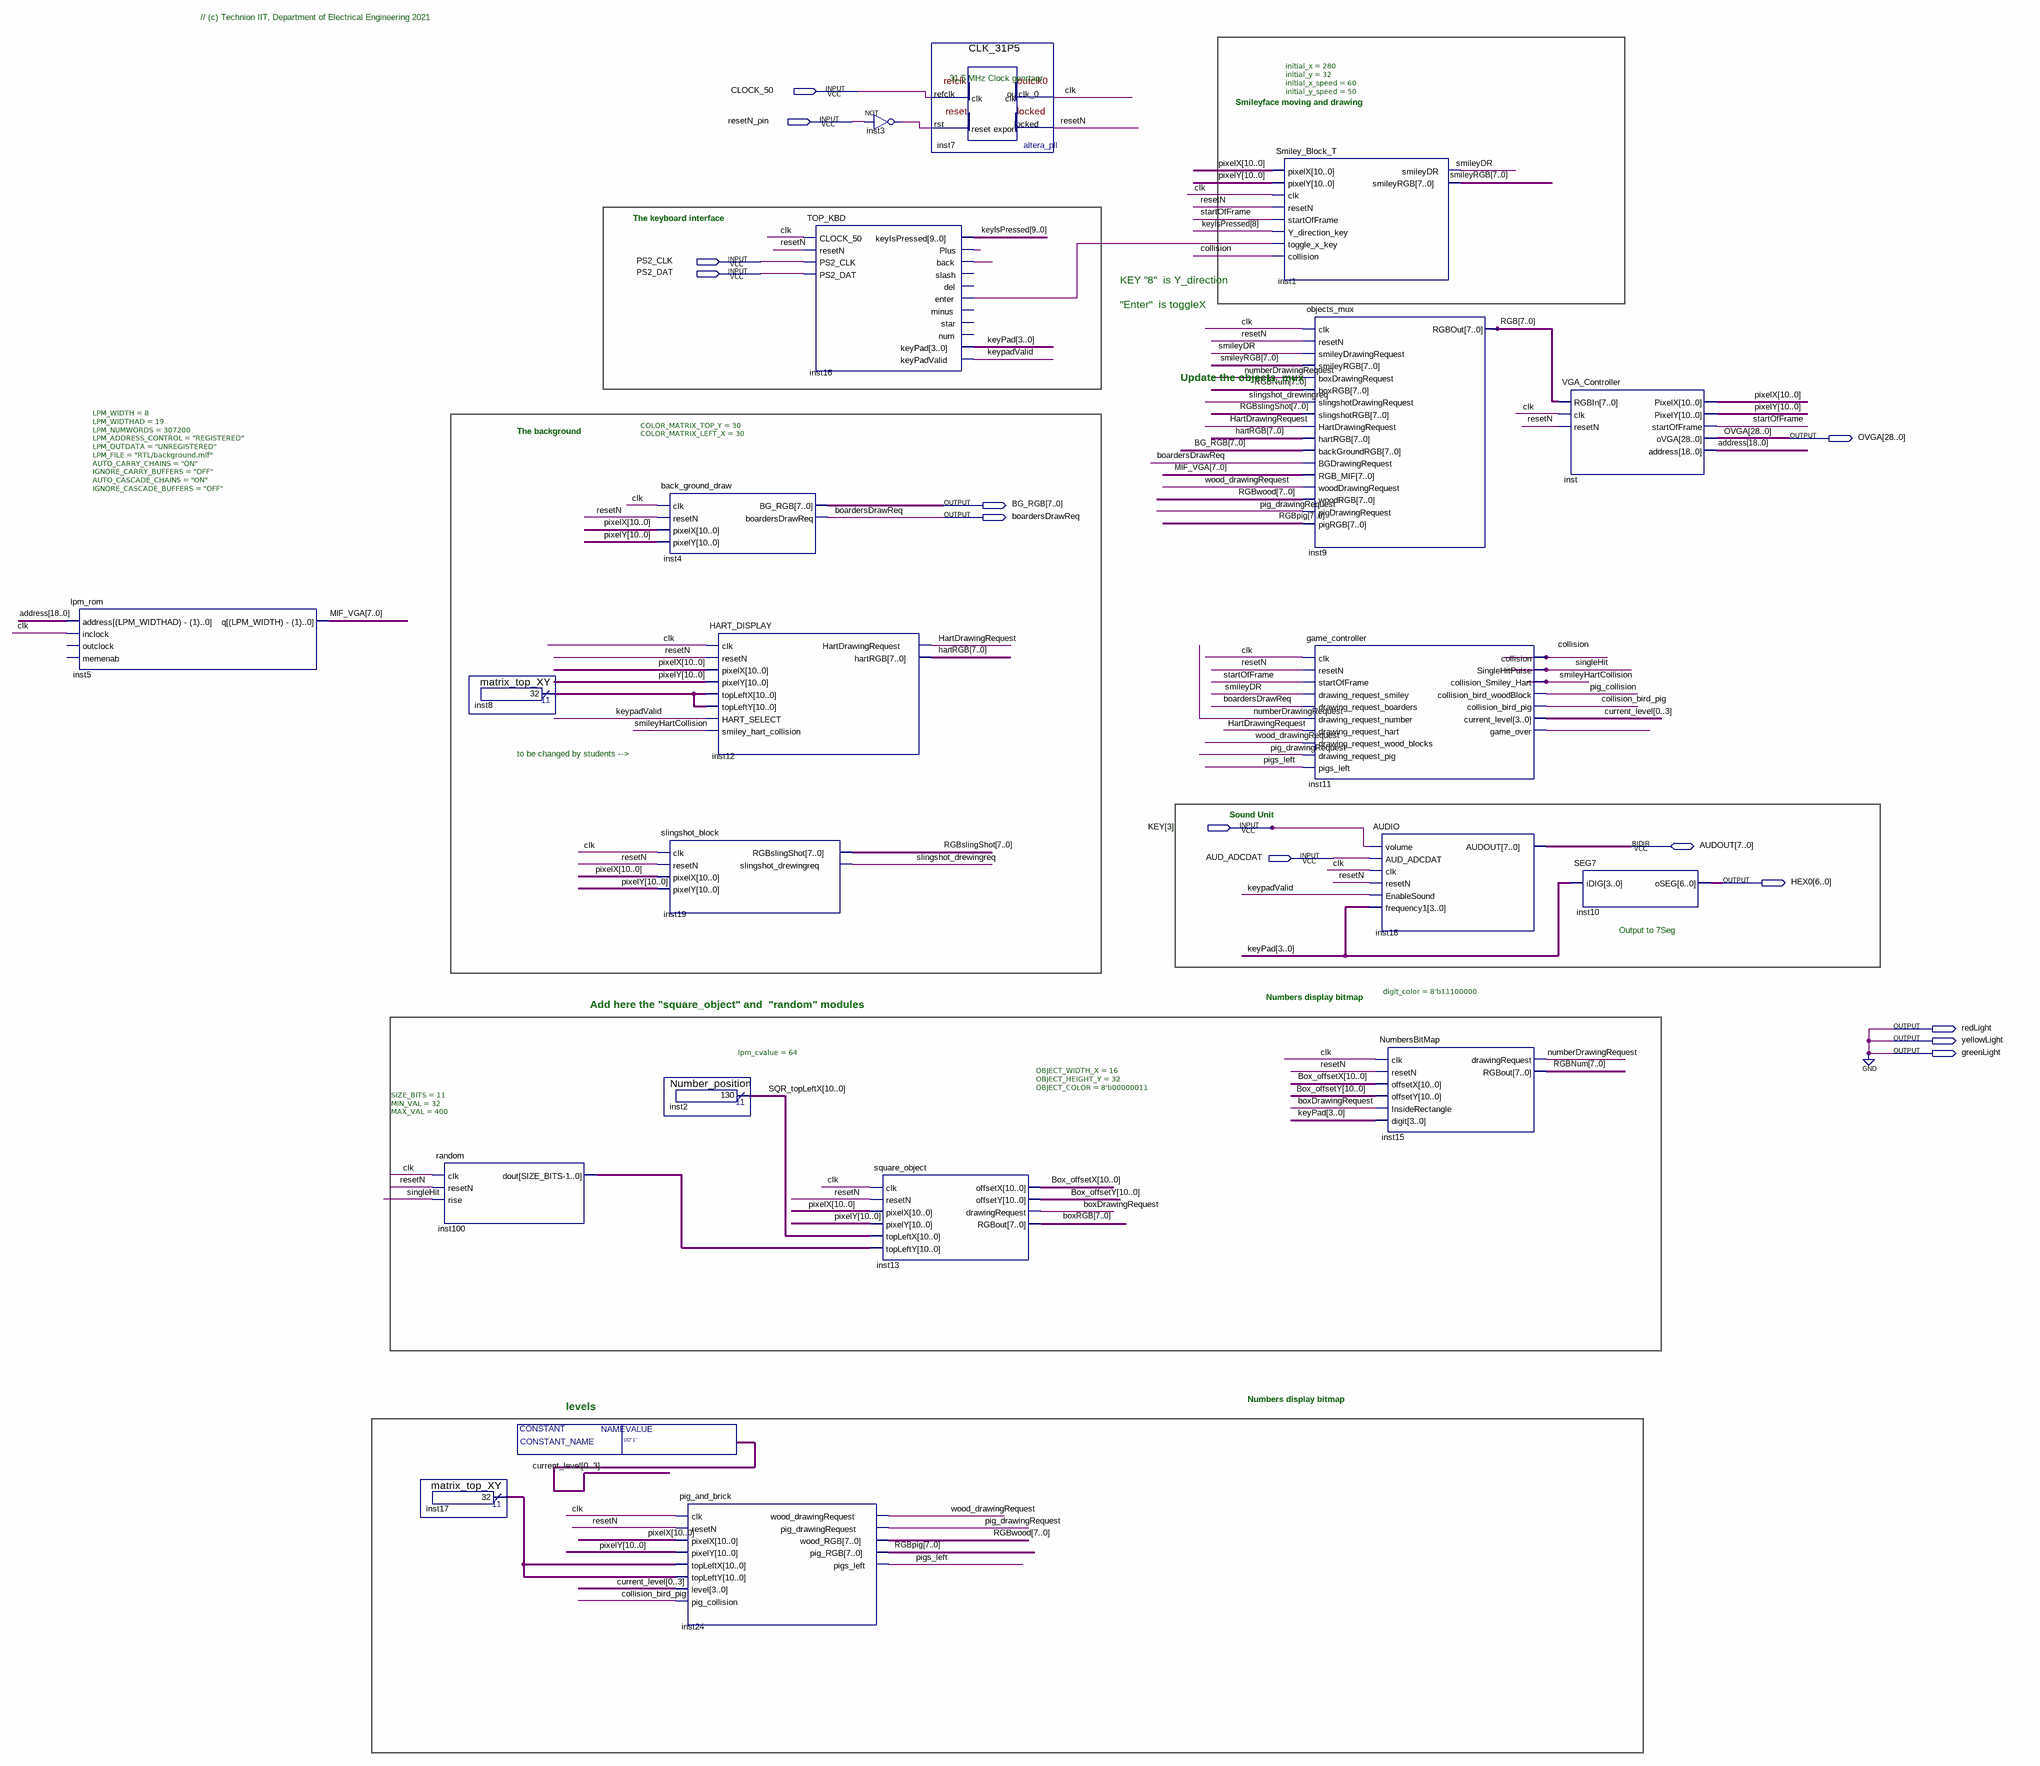
[diagram p0: schematic sheet]
// Quartus schematic TOP_VGA_DEMO_KBD_TWO.bdf as structural Verilog: 20 symbols, 14 pins
module TOP_VGA_DEMO_KBD_TWO #(parameter CONSTANT_NAME = "UD\"1\"") (
  input  CLOCK_50,
  input  resetN_pin,
  input  PS2_CLK,
  input  PS2_DAT,
  input  [3:3] KEY,
  input  AUD_ADCDAT,
  inout  [7:0] AUDOUT,
  output [28:0] OVGA,
  output [7:0] BG_RGB,
  output boardersDrawReq,
  output [6:0] HEX0,
  output redLight,
  output yellowLight,
  output greenLight
);

  wire boxDrawingRequest, clk, collision, collision_bird_pig, HartDrawingRequest, inst3_out,
       inst11_game_over, inst16_back, inst16_enter, inst16_plus, keypadValid, numberDrawingRequest,
       pig_collision, pig_drawingRequest, pigs_left, resetN, singleHit, slingshot_drewingreq, smileyDR,
       smileyHartCollision, startOfFrame, wood_drawingRequest;
  wire [3:0] current_level, keyPad;
  wire [7:0] boxRGB, hartRGB, MIF_VGA, RGB, RGBNum, RGBpig, RGBslingShot, RGBwood, smileyRGB;
  wire [9:0] keyIsPressed;
  wire [10:0] Box_offsetX, Box_offsetY, inst8_result, inst17_result, inst100_dout, pixelX, pixelY,
       SQR_topLeftX;
  wire [18:0] address;

  lpm_rom #(.LPM_WIDTH(8), .LPM_WIDTHAD(19), .LPM_NUMWORDS(307200), .LPM_ADDRESS_CONTROL("REGISTERED"), .LPM_OUTDATA("UNREGISTERED"), .LPM_FILE("RTL/background.mif"), .AUTO_CARRY_CHAINS("ON"), .IGNORE_CARRY_BUFFERS("OFF"), .AUTO_CASCADE_CHAINS("ON"), .IGNORE_CASCADE_BUFFERS("OFF")) inst5 (
    .address(address), .inclock(clk), .q(MIF_VGA));  // open: outclock, memenab
  random #(.SIZE_BITS(11), .MIN_VAL(32), .MAX_VAL(400)) inst100 (
    .clk(clk), .resetN(resetN), .rise(singleHit), .dout(inst100_dout));
  matrix_top_XY inst17 (.result(inst17_result));
  matrix_top_XY inst8 (.result(inst8_result));
  back_ground_draw #(.COLOR_MATRIX_TOP_Y(30), .COLOR_MATRIX_LEFT_X(30)) inst4 (
    .clk(clk), .resetN(resetN), .pixelX(pixelX), .pixelY(pixelY), .BG_RGB(BG_RGB),
    .boardersDrawReq(boardersDrawReq));
  slingshot_block inst19 (
    .clk(clk), .resetN(resetN), .pixelX(pixelX), .pixelY(pixelY), .RGBslingShot(RGBslingShot),
    .slingshot_drewingreq(slingshot_drewingreq));
  Number_position #(.lpm_cvalue(64)) inst2 (.result(SQR_topLeftX));
  pig_and_brick inst24 (
    .clk(clk), .resetN(resetN), .pixelX(pixelX), .pixelY(pixelY), .topLeftX(inst17_result),
    .topLeftY(inst17_result),
    .level({current_level[0], current_level[1], current_level[2], current_level[3]}),
    .pig_collision(collision_bird_pig), .wood_drawingRequest(wood_drawingRequest),
    .pig_drawingRequest(pig_drawingRequest), .wood_RGB(RGBwood), .pig_RGB(RGBpig), .pigs_left(pigs_left));
  HART_DISPLAY inst12 (
    .clk(clk), .resetN(resetN), .pixelX(pixelX), .pixelY(pixelY), .topLeftX(inst8_result),
    .topLeftY(inst8_result), .HART_SELECT(keypadValid), .smiley_hart_collision(smileyHartCollision),
    .HartDrawingRequest(HartDrawingRequest), .hartRGB(hartRGB));
  TOP_KBD inst16 (
    .CLOCK_50(clk), .resetN(resetN), .PS2_CLK(PS2_CLK), .PS2_DAT(PS2_DAT), .keyIsPressed(keyIsPressed),
    .Plus(inst16_plus), .back(inst16_back), .enter(inst16_enter), .keyPad(keyPad), .keyPadValid(keypadValid));  // open: slash, del, minus, star, num
  not inst3 (inst3_out, resetN_pin);
  square_object #(.OBJECT_WIDTH_X(16), .OBJECT_HEIGHT_Y(32), .OBJECT_COLOR(8'b00000011)) inst13 (
    .clk(clk), .resetN(resetN), .pixelX(pixelX), .pixelY(pixelY), .topLeftX(SQR_topLeftX),
    .topLeftY(inst100_dout), .offsetX(Box_offsetX), .offsetY(Box_offsetY),
    .drawingRequest(boxDrawingRequest), .RGBout(boxRGB));
  CLK_31P5 inst7 (.refclk(CLOCK_50), .rst(inst3_out), .outclk_0(clk), .locked(resetN));
  Smiley_Block_T #(.initial_x(280), .initial_y(32), .initial_x_speed(60), .initial_y_speed(50)) inst1 (
    .pixelX(pixelX), .pixelY(pixelY), .clk(clk), .resetN(resetN), .startOfFrame(startOfFrame),
    .Y_direction_key(keyIsPressed[8]), .toggle_x_key(inst16_enter), .collision(collision),
    .smileyDR(smileyDR), .smileyRGB(smileyRGB));
  objects_mux inst9 (
    .clk(clk), .resetN(resetN), .smileyDrawingRequest(smileyDR), .smileyRGB(smileyRGB),
    .boxDrawingRequest(numberDrawingRequest), .boxRGB(RGBNum),
    .slingshotDrawingRequest(slingshot_drewingreq), .slingshotRGB(RGBslingShot),
    .HartDrawingRequest(HartDrawingRequest), .hartRGB(hartRGB), .backGroundRGB(BG_RGB),
    .BGDrawingRequest(boardersDrawReq), .RGB_MIF(MIF_VGA), .woodDrawingRequest(wood_drawingRequest),
    .woodRGB(RGBwood), .pigDrawingRequest(pig_drawingRequest), .pigRGB(RGBpig), .RGBOut(RGB));
  game_controller inst11 (
    .clk(clk), .resetN(resetN), .startOfFrame(startOfFrame), .drawing_request_smiley(smileyDR),
    .drawing_request_boarders(boardersDrawReq), .drawing_request_number(numberDrawingRequest),
    .drawing_request_hart(HartDrawingRequest), .drawing_request_wood_blocks(wood_drawingRequest),
    .drawing_request_pig(pig_drawingRequest), .pigs_left(pigs_left), .collision(collision),
    .SingleHitPulse(singleHit), .collision_Smiley_Hart(smileyHartCollision),
    .collision_bird_woodBlock(pig_collision), .collision_bird_pig(collision_bird_pig),
    .current_level({current_level[0], current_level[1], current_level[2], current_level[3]}),
    .game_over(inst11_game_over));
  AUDIO inst18 (
    .volume(KEY[3]), .AUD_ADCDAT(AUD_ADCDAT), .clk(clk), .resetN(resetN), .EnableSound(keypadValid),
    .frequency1(keyPad), .AUDOUT(AUDOUT));
  NumbersBitMap #(.digit_color(8'b11100000)) inst15 (
    .clk(clk), .resetN(resetN), .offsetX(Box_offsetX), .offsetY(Box_offsetY),
    .InsideRectangle(boxDrawingRequest), .digit(keyPad), .drawingRequest(numberDrawingRequest),
    .RGBout(RGBNum));
  VGA_Controller inst (
    .RGBIn(RGB), .clk(clk), .resetN(resetN), .PixelX(pixelX), .PixelY(pixelY), .startOfFrame(startOfFrame),
    .oVGA(OVGA), .address(address));
  SEG7 inst10 (.iDIG(keyPad), .oSEG(HEX0));

  assign greenLight = 1'b0;
  assign redLight = 1'b0;
  assign yellowLight = 1'b0;

  // Notes on the sheet:
  //   // (c) Technion IIT, Department of Electrical Engineering 2021
  //   31.5 MHz Clock genrtaor
  //   Smileyface moving and drawing
  //   The keyboard interface
  //   KEY "8"  is Y_direction
  //   "Enter"  is toggleX
  //   Update the objects_mux
  //   The background
  //   to be changed by students -->
  //   Sound Unit
  //   Output to 7Seg
  //   Numbers display bitmap
  //   Add here the "square_object" and  "random" modules
  //   Numbers display bitmap
  //   levels
endmodule
